# Altium schematic sheet modeSelection.SchDoc
size A
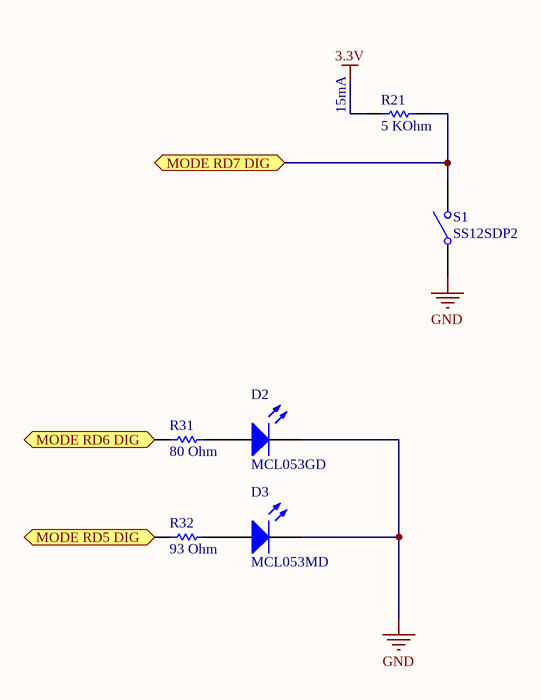
[diagram p0: modeSelection.SchDoc]

## Parts
D2  MCL053GD  [LedGreen]
D3  MCL053MD  [LedGreen]
R21  5 KOhm  [Resistor0603]
R31  80 Ohm  [Resistor0603]
R32  93 Ohm  [Resistor0603]
S1  SS12SDP2  [Switch]

## Ports
MODE RD5 DIG, MODE RD6 DIG, MODE RD7 DIG

## Nets
3.3V: R21.2
GND: D2.2(K) D3.2(K) S1.1(COMMON)
MODE RD5 DIG: R32.1 ; port MODE RD5 DIG
MODE RD6 DIG: R31.1 ; port MODE RD6 DIG
MODE RD7 DIG: R21.1 S1.2(NO) ; port MODE RD7 DIG
NetD2_1: D2.1(A) R31.2
NetD3_1: D3.1(A) R32.2

## Notes on the sheet
- (near R21) 15mA

## Library data of the parts
D2 D3 = LED0: Typical INFRARED GaAs LED; Published: 8-Jun-2000; LatestRevisionDate: 08-Jul-2005; LatestRevisionNote: Mech Layer 1 removed.; PackageReference: LED-0; Publisher: Altium Limited; PackageDescription: LED; 2 Leads
  D2: Farnell Reference: 1581138
  D3: Farnell Reference: 1581137
R21 R31 R32 = Res1: Resistor; Published: 8-Jun-2000; LatestRevisionDate: 17-Jul-2002; LatestRevisionNote: Re-released for DXP Platform.; PackageReference: AXIAL-0.3; Publisher: Altium Limited; PackageDescription: Axial Device, Thru-Hole; 2 Leads; 0.3 in Pin Spacing
  R21: Value: 5 KOhm
  R31: Value: 80 Ohm
  R32: Value: 93 Ohm
S1 = SW-SPST: Single-Pole, Single-Throw Switch; Published: 24-Mar-1999; LatestRevisionDate: 17-Jul-2002; LatestRevisionNote: Re-released for DXP Platform.; PackageReference: SPST-2; Publisher: Altium Limited; PackageDescription: Switch; 2 Leads; Farnell Reference: 1524325